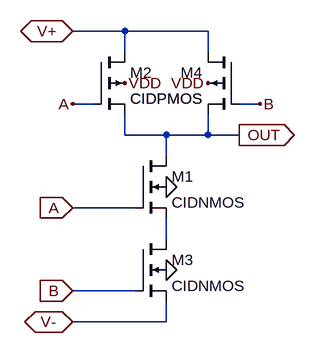
[diagram p0: schematic NAND2X1.asc]
NAND2X1.asc, the LTspice schematic file:
Version 4.1
SHEET 1 880 680
WIRE 16 -80 -64 -80
WIRE 144 -80 16 -80
WIRE 16 -48 16 -80
WIRE 144 -48 144 -80
WIRE -32 32 -64 32
WIRE 224 32 192 32
WIRE 16 80 16 48
WIRE 80 80 16 80
WIRE 144 80 144 48
WIRE 144 80 80 80
WIRE 192 80 144 80
WIRE 80 112 80 80
WIRE 32 192 -64 192
WIRE 80 240 80 208
WIRE 32 320 -64 320
WIRE 80 368 80 336
WIRE 80 368 -64 368
FLAG -64 192 A
IOPIN -64 192 In
FLAG -64 320 B
IOPIN -64 320 In
FLAG 192 80 OUT
IOPIN 192 80 Out
FLAG -64 32 A
FLAG 224 32 B
FLAG -64 368 V-
IOPIN -64 368 BiDir
FLAG -64 -80 V+
IOPIN -64 -80 BiDir
FLAG 80 288 0
FLAG 80 160 0
FLAG 16 0 VDD
FLAG 144 0 VDD
SYMBOL nmos4 32 112 R0
SYMATTR InstName M1
SYMATTR Value CIDNMOS
SYMATTR Value2 l=5u w=10u
SYMBOL pmos4 -32 -48 R0
SYMATTR InstName M2
SYMATTR Value CIDPMOS
SYMATTR Value2 l=5u w=25u
SYMBOL nmos4 32 240 R0
SYMATTR InstName M3
SYMATTR Value CIDNMOS
SYMATTR Value2 l=5u w=10u
SYMBOL pmos4 192 -48 M0
SYMATTR InstName M4
SYMATTR Value CIDPMOS
SYMATTR Value2 l=5u w=25u

The netlist it stands for:
* NAND2X1.asc
M1 OUT A N001 0 CIDNMOS l=5u w=10u
M2 V+ A OUT VDD CIDPMOS l=5u w=25u
M3 N001 B V- 0 CIDNMOS l=5u w=10u
M4 V+ B OUT VDD CIDPMOS l=5u w=25u
.model NMOS NMOS
.model PMOS PMOS
.lib standard.mos
.backanno
.end